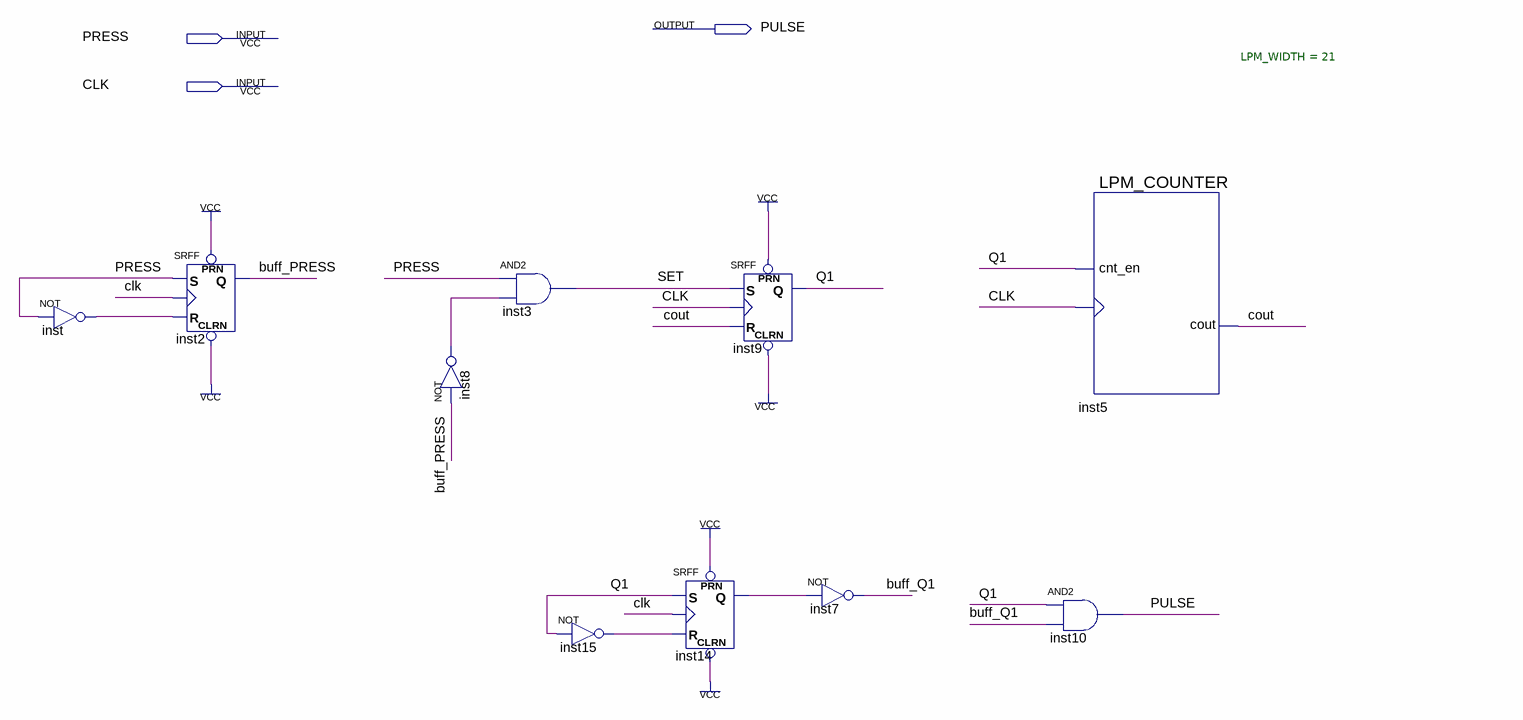
[diagram p0: schematic sheet]
// Quartus schematic g09_pulse_generator.bdf as structural Verilog: 10 symbols, 3 pins
module g09_pulse_generator (
  input  PRESS,
  input  CLK,
  output PULSE
);

  wire buff_PRESS, buff_Q1, cout, inst8_out, inst14_q, inst15_out, inst_out, Q1, SET;

  not inst (inst_out, PRESS);
  SRFF inst2 (.PRN(1'b1), .CLRN(1'b1), .S(PRESS), .R(inst_out), .CLK(CLK), .Q(buff_PRESS));
  not inst8 (inst8_out, buff_PRESS);
  and inst3 (SET, PRESS, inst8_out);
  not inst15 (inst15_out, Q1);
  SRFF inst14 (.PRN(1'b1), .CLRN(1'b1), .S(Q1), .R(inst15_out), .CLK(CLK), .Q(inst14_q));
  SRFF inst9 (.PRN(1'b1), .CLRN(1'b1), .S(SET), .R(cout), .CLK(CLK), .Q(Q1));
  not inst7 (buff_Q1, inst14_q);
  LPM_COUNTER #(.LPM_WIDTH(21)) inst5 (.clock(CLK), .cnt_en(Q1), .cout(cout));
  and inst10 (PULSE, Q1, buff_Q1);
endmodule
